# EAGLE design dice-2 (EAGLE 7.1.0)
CNAME: Pyrina; CREVISION: 1.0; DESIGNER: Jos Bodewes
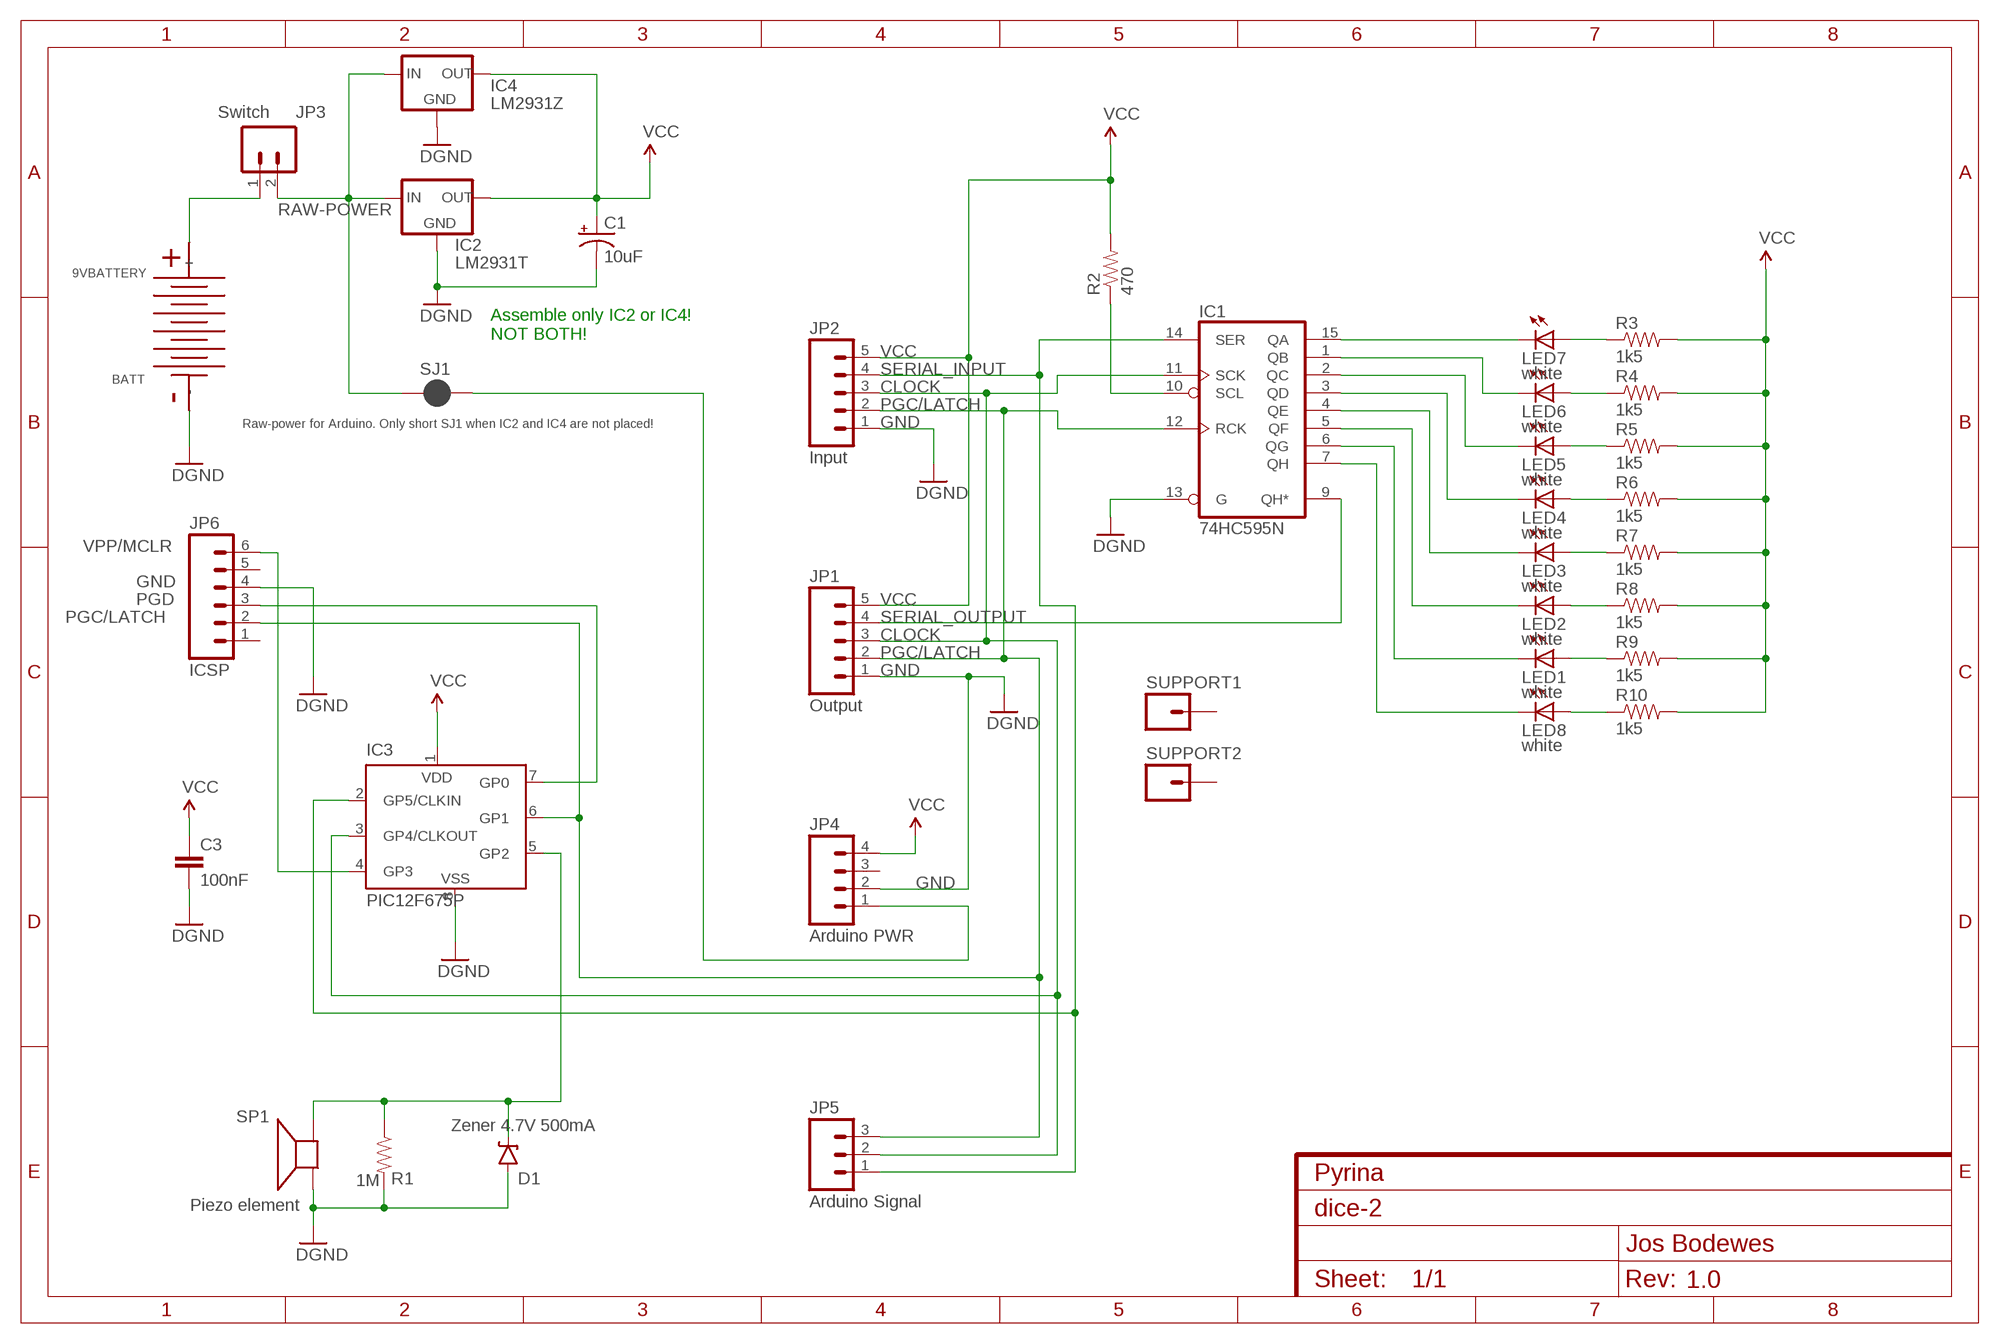
[diagram p0: schematic, sheet 1]

## Parts
BATT  9VBATTERY  [9V-BATTERY-HOLDER]
C1  10uF  CAP_POLPTH2  [CPOL-RADIAL-10UF-25V]
C3  100nF  CAPPTH1  [CAP-PTH-5MM]
D1  Zener 4.7V 500mA  DIODE-ZENERPTH  [DIODE-ZENER]
IC1  74HC595N  [DIL16]
IC2  LM2931T  [TO220S]
IC3  PIC12F675P  [DIL8]
IC4  LM2931Z  [TO92]
JP1  Output  M05PTH  [1X05]
JP2  Input  M05PTH  [1X05]
JP3  Switch  M02PTH  [1X02]
JP4  Arduino PWR  M04PTH  [1X04]
JP5  Arduino Signal  M03PTH  [1X03]
JP6  ICSP  M06SIP_LOCK  [1X06-SIP_LOCK]
LED1  white  LED5MM  [LED5MM]
LED2  white  LED5MM  [LED5MM]
LED3  white  LED5MM  [LED5MM]
LED4  white  LED5MM  [LED5MM]
LED5  white  LED5MM  [LED5MM]
LED6  white  LED5MM  [LED5MM]
LED7  white  LED5MM  [LED5MM]
LED8  white  LED5MM  [LED5MM]
R1  1M  RESISTORPTH-1/4W  [AXIAL-0.4]
R2  470  RESISTORPTH-1/4W  [AXIAL-0.4]
R3  1k5  RESISTORPTH-1/4W  [AXIAL-0.4]
R4  1k5  RESISTORPTH-1/4W  [AXIAL-0.4]
R5  1k5  RESISTORPTH-1/4W  [AXIAL-0.4]
R6  1k5  RESISTORPTH-1/4W  [AXIAL-0.4]
R7  1k5  RESISTORPTH-1/4W  [AXIAL-0.4]
R8  1k5  RESISTORPTH-1/4W  [AXIAL-0.4]
R9  1k5  RESISTORPTH-1/4W  [AXIAL-0.4]
R10  1k5  RESISTORPTH-1/4W  [AXIAL-0.4]
SJ1  Raw-power for Arduino. Only short SJ1 when IC2 and IC4 are not placed!  JUMPER-PAD-2-NC_BY_PASTE  [PAD-JUMPER-2-NC_BY_PASTE_YES_SILK]
SP1  Piezo element  SPEAKER/PS12  [PS12]
SUPPORT1  M01PTH  [1X01]
SUPPORT2  M01PTH  [1X01]

## Nets
CLOCK: IC1.11(SCK) IC3.3(GP4/CLKOUT) JP1.3 JP2.3 JP5.2
GND: BATT.- C1.2(-) C3.2 D1.P$2(A) IC1.13(G) IC2.2(GND) IC3.8(VSS) IC4.2(GND) JP1.1 JP2.1 JP4.2 JP6.4 R1.P$2 SP1.P$1(+) ; supply symbol labelled DGND
N$1: IC1.15(QA) LED7.K(C)
N$2: IC1.1(QB) LED6.K(C)
N$3: IC1.5(QF) LED2.K(C)
N$4: IC1.2(QC) LED5.K(C)
N$5: IC1.3(QD) LED4.K(C)
N$6: IC1.4(QE) LED3.K(C)
N$7: LED6.A R4.P$1
N$8: IC1.6(QG) LED1.K(C)
N$9: LED7.A R3.P$1
N$10: LED5.A R5.P$1
N$11: LED4.A R6.P$1
N$12: LED3.A R7.P$1
N$13: LED1.A R9.P$1
N$14: BATT.+ JP3.1
N$16: IC1.7(QH) LED8.K(C)
N$17: LED8.A R10.P$1
N$18: IC1.10(SCL) R2.P$1
N$19: D1.P$1(C) IC3.5(GP2) R1.P$1 SP1.P$2(-)
N$20: JP4.1 SJ1.2
N$22: LED2.A R8.P$1
PGC/LATCH: IC1.12(RCK) IC3.6(GP1) JP1.2 JP2.2 JP5.3 JP6.2
PGD: IC3.7(GP0) JP6.3
RAW-POWER: IC2.1(IN) IC4.3(IN) JP3.2 SJ1.1
SERIAL_INPUT: IC1.14(SER) IC3.2(GP5/CLKIN) JP2.4 JP5.1
SERIAL_OUTPUT: IC1.9(QH*) JP1.4
VCC: C1.1(+) C3.1 IC2.3(OUT) IC3.1(VDD) IC4.1(OUT) JP1.5 JP2.5 JP4.4 R2.P$2 R3.P$2 R4.P$2 R5.P$2 R6.P$2 R7.P$2 R8.P$2 R9.P$2 R10.P$2
VPP/MCLR: IC3.4(GP3) JP6.6
Unconnected: JP4.3 JP6.1 JP6.5 SUPPORT1.1 SUPPORT2.1

## Notes on the sheet
- Assemble only IC2 or IC4!
  NOT BOTH!

## Power pins joined to a net without a drawn wire
GND: IC1.8(GND)
VCC: IC1.16(VCC)

## Library data of the parts
BATT = battery:9VBATTERY: 9V battery
C1 = SparkFun-Capacitors:CAP_POL: Capacitor Polarized These are standard SMD and PTH capacitors. Normally 10uF, 47uF, and 100uF in electrolytic and tantalum varieties. Always verify the external diameter of the through hole cap, it varies with capacity, voltage, and manufacturer. The EIA devices should be standard.
C3 = SparkFun-Capacitors:CAP: Capacitor Standard 0603 ceramic capacitor, and 0.1" leaded capacitor.
D1 = SparkFun-DiscreteSemi:DIODE-ZENER: Zener Diode Production Part - 8199 3.4V Zener Voltage
IC1 = 74xx-eu:74*595: 8-bit SHIFT REGISTER, output latch
IC2 IC4 = v-reg-3:LM2931: National Semiconductor <http://www.national.com> Low Dropout Fixed Regulator Vin up to 26V, Reverse Batterie/Load Dump/Short Circuit/Overload Protection,
IC3 = microchip:PIC12F6*: Data Sheet 8-Pin FLASH-Based 8-Bit CMOS Microcontrollers Source: http://www.microchip.com .. 41190c.pdf; MF: MICROCHIP; MPN: PIC12F675-E/P; OC_FARNELL: 9759018; OC_NEWARK: 92C4340
JP1 JP2 = SparkFun-Connectors:M05: Header 5 Standard 5-pin 0.1" header. Use with straight break away headers (SKU : PRT-00116), right angle break away headers (PRT-00553), swiss pins (PRT-00743), machine pins (PRT-00117), and female headers (PRT-00115). Molex polarized connector foot print use with SKU : PRT-08230 with associated crimp pins and housings.
JP3 = SparkFun-Connectors:M02: Standard 2-pin 0.1" header. Use with - straight break away headers ( PRT-00116) - right angle break away headers (PRT-00553) - swiss pins (PRT-00743) - machine pins (PRT-00117) - female headers (PRT-00115) Molex polarized connector foot print use with: PRT-08233 with associated crimp pins and housings. 2.54_SCREWTERM for use with PRT-10571. 3.5mm Screw Terminal footprints for PRT-08084 5mm Screw Terminal footprints for use with PRT-08432
JP4 = SparkFun-Connectors:M04: Header 4 Standard 4-pin 0.1" header. Use with straight break away headers (SKU : PRT-00116), right angle break away headers (PRT-00553), swiss pins (PRT-00743), machine pins (PRT-00117), and female headers (PRT-00115). Molex polarized connector foot print use with SKU : PRT-08231 with associated crimp pins and housings. 1MM SMD Version SKU: PRT-10208
JP5 = SparkFun-Connectors:M03: Header 3 Standard 3-pin 0.1" header. Use with straight break away headers (SKU : PRT-00116), right angle break away headers (PRT-00553), swiss pins (PRT-00743), machine pins (PRT-00117), and female headers (PRT-00115). Molex polarized connector foot print use with SKU : PRT-08232 with associated crimp pins and housings.
JP6 = SparkFun-Connectors:M06: Header 6 Standard 6-pin 0.1" header. Use with straight break away headers (SKU : PRT-00116), right angle break away headers (PRT-00553), swiss pins (PRT-00743), machine pins (PRT-00117), and female headers (PRT-00115). Molex polarized connector foot print use with SKU : PRT-08094 with associated crimp pins and housings. NOTES ON THE VARIANTS LOCK and LOCK_LONGPADS... This footprint was designed to help hold the alignment of a through-hole component (i.e. 6-pin header) while soldering it into place. You may notice that each hole has been shifted either up or down by 0.005 of an inch from it's more standard position (which is a perfectly straight line). This slight alteration caused the pins (the squares in the middle) to touch the edges of the holes. Because they are alternating, it causes a "brace" to hold the component in place. 0.005 has proven to be the perfect amount of "off-center" position when using our standard breakaway headers. Although looks a little odd when you look at the bare footprint, once you have a header in there, the alteration is very hard to notice. Also,if you push a header all the way into place, it is covered up entirely on the bottom side. This idea of altering the position of holes to aid alignment will be further integrated into the Sparkfun Library for other footprints. It can help hold any component with 3 or more connection pins.
LED1-LED8 = led:LED: LED OSRAM: - CHIPLED LG R971, LG N971, LY N971, LG Q971, LY Q971, LO R971, LY R971 LH N974, LH R974 LS Q976, LO Q976, LY Q976 LO Q996 - Hyper CHIPLED LW Q18S LB Q993, LB Q99A, LB R99A - SideLED LS A670, LO A670, LY A670, LG A670, LP A670 LB A673, LV A673, LT A673, LW A673 LH A674 LY A675 LS A676, LA A676, LO A676, LY A676, LW A676 LS A679, LY A679, LG A679 - Hyper Micro SIDELED® LS Y876, LA Y876, LO Y876, LY Y876 LT Y87S - SmartLED LW L88C, LW L88S LB L89C, LB L89S, LG L890 LS L89K, LO L89K, LY L89K LS L896, LA L896, LO L896, LY L896 - TOPLED LS T670, LO T670, LY T670, LG T670, LP T670 LSG T670, LSP T670, LSY T670, LOP T670, LYG T670 LG T671, LOG T671, LSG T671 LB T673, LV T673, LT T673, LW T673 LH T674 LS T676, LA T676, LO T676, LY T676, LB T676, LH T676, LSB T676, LW T676 LB T67C, LV T67C, LT T67C, LS T67K, LO T67K, LY T67K, LW E67C LS E67B, LA E67B, LO E67B, LY E67B, LB E67C, LV E67C, LT E67C LW T67C LS T679, LY T679, LG T679 LS T770, LO T770, LY T770, LG T770, LP T770 LB T773, LV T773, LT T773, LW T773 LH T774 LS E675, LA E675, LY E675, LS T675 LS T776, LA T776, LO T776, LY T776, LB T776 LHGB T686 LT T68C, LB T68C - Hyper Mini TOPLED® LB M676 - Mini TOPLED Santana® LG M470 LS M47K, LO M47K, LY M47K Source: http://www.osram.convergy.de LUXEON: - LUMILED® LXK2-PW12-R00, LXK2-PW12-S00, LXK2-PW14-U00, LXK2-PW14-V00 LXK2-PM12-R00, LXK2-PM12-S00, LXK2-PM14-U00 LXK2-PE12-Q00, LXK2-PE12-R00, LXK2-PE12-S00, LXK2-PE14-T00, LXK2-PE14-U00 LXK2-PB12-K00, LXK2-PB12-L00, LXK2-PB12-M00, LXK2-PB14-N00, LXK2-PB14-P00, LXK2-PB14-Q00 LXK2-PR12-L00, LXK2-PR12-M00, LXK2-PR14-Q00, LXK2-PR14-R00 LXK2-PD12-Q00, LXK2-PD12-R00, LXK2-PD12-S00 LXK2-PH12-R00, LXK2-PH12-S00 LXK2-PL12-P00, LXK2-PL12-Q00, LXK2-PL12-R00 Source: www.luxeon.com KINGBRIGHT: KA-3528ASYC Source: www.kingbright.com
R1-R10 = SparkFun-Resistors:RESISTOR: Resistor Basic schematic elements and footprints for 0603, 1206, and PTH resistors.
SJ1 = SparkFun-Passives:JUMPER-PAD-2-NC_BY_PASTE
SP1 = adafruit:SPEAKER: SPEAKER Source: Buerklin Added PS12 (for part # PS1240 piezo) http://www.ladyada.net/library/pcb/eaglelibrary.html
SUPPORT1 SUPPORT2 = SparkFun-Connectors:M01: Header 1 Standard 1-pin 0.1" header. Use with straight break away headers (SKU : PRT-00116), right angle break away headers (PRT-00553), swiss pins (PRT-00743), machine pins (PRT-00117), and female headers (PRT-00115).

## Net classes
0 default: width 0.4 mm, clearance 0.205 mm
1 GND: width 0.4 mm

## Board
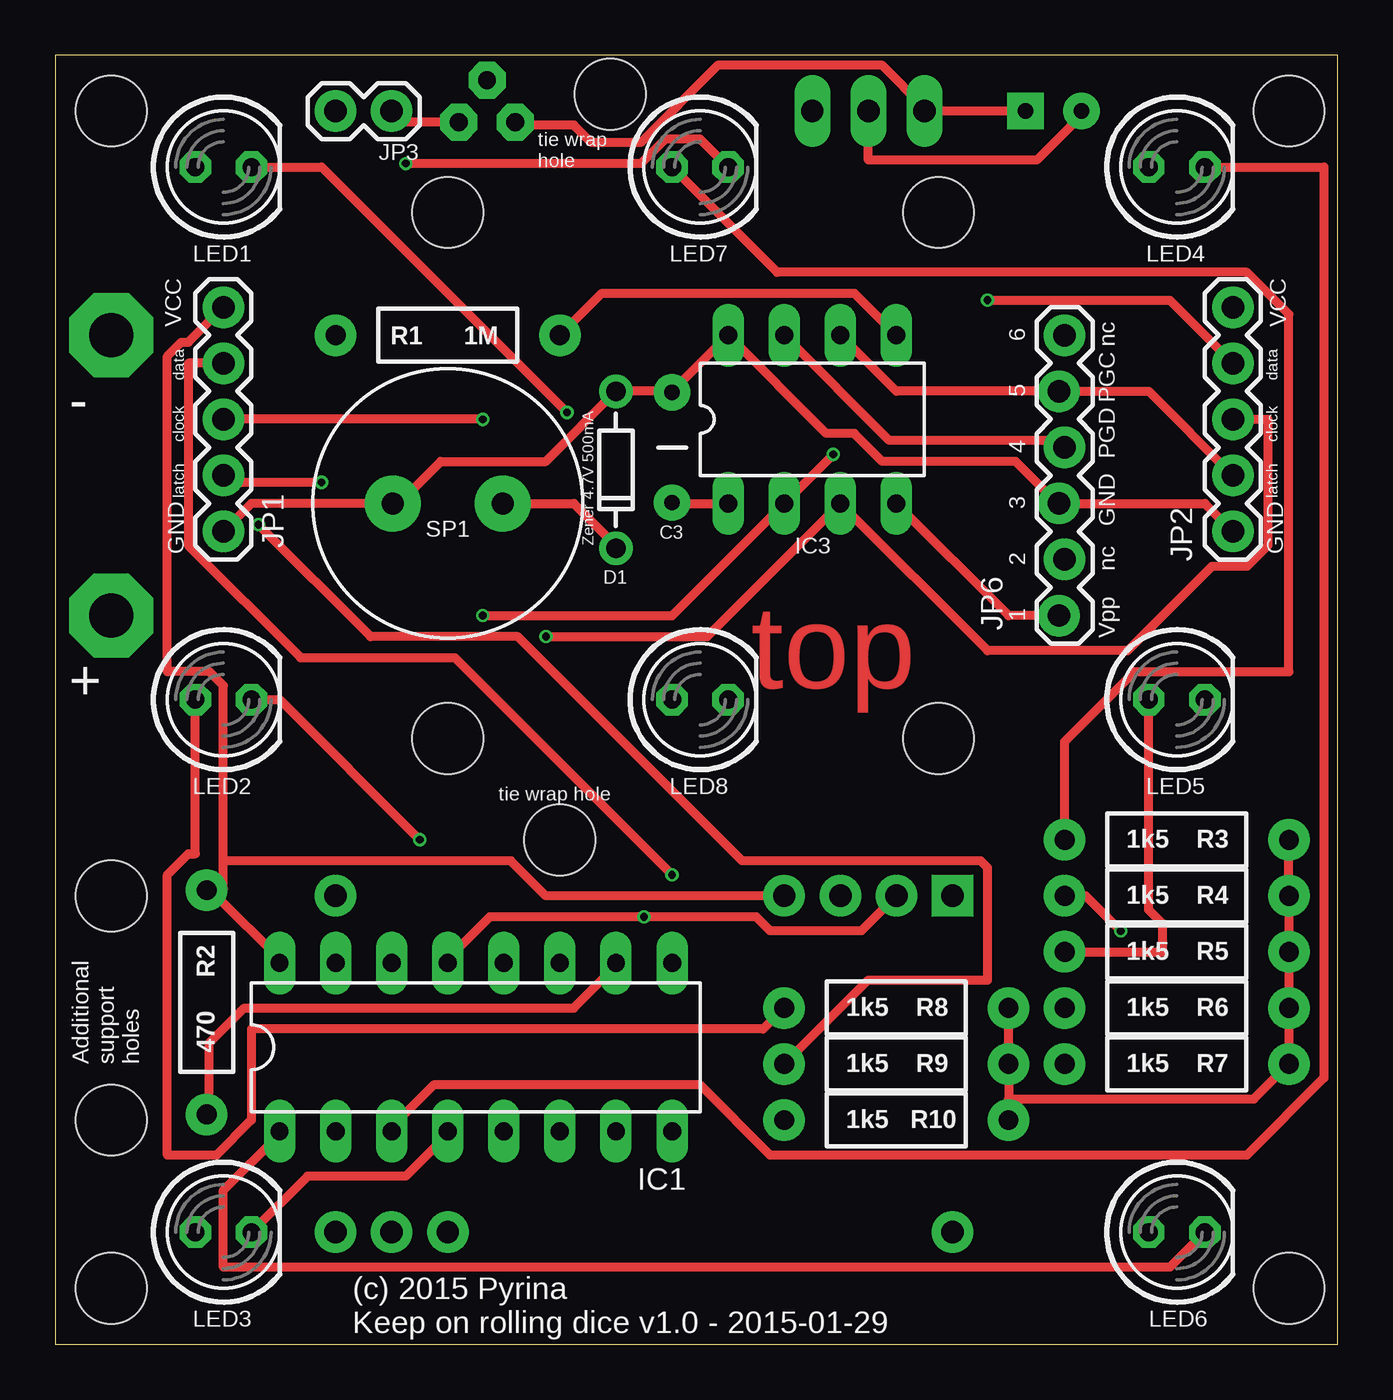
[diagram p1: board, top side]
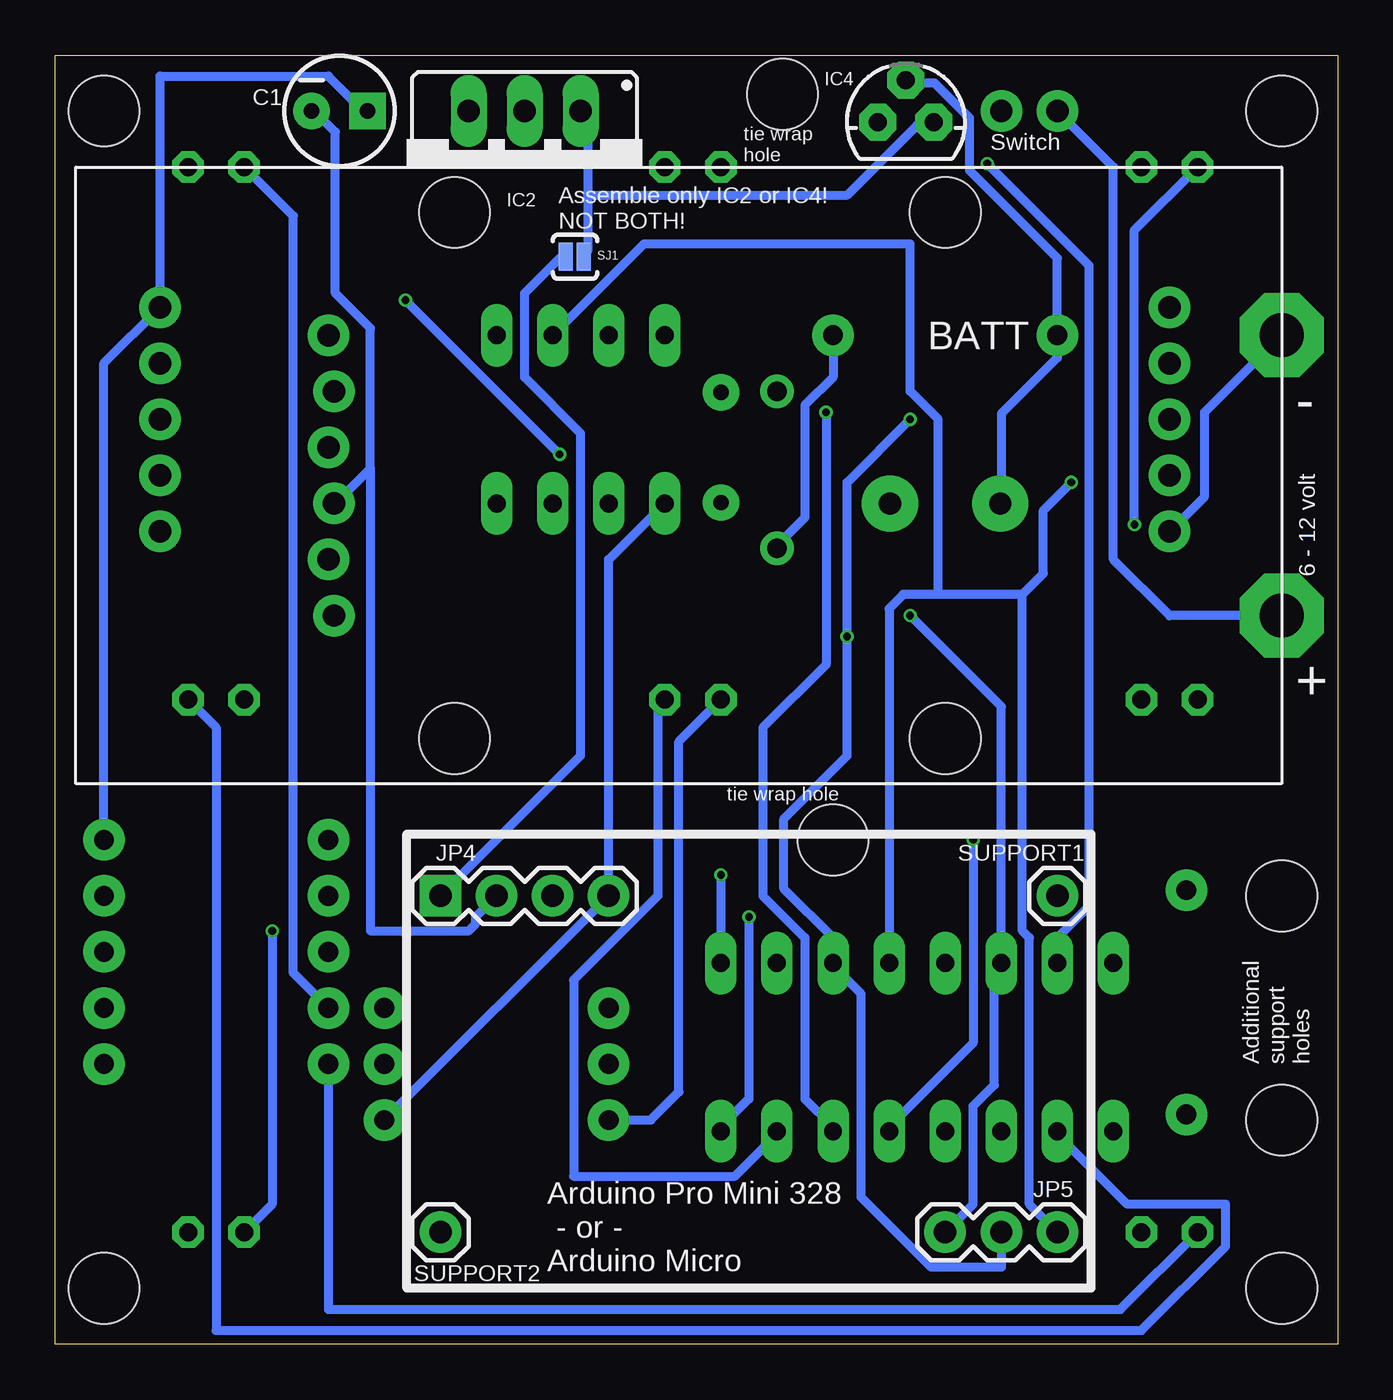
[diagram p2: board, bottom side, seen from below]

Size 58.09 x 58.41 mm. Coordinates in mm from the lower left corner, seen from the top.
Outline: 0,0 58.09,0 58.09,58.41 0,58.41 0,0
Copper layers (1*16): Top 0.018mm / dielectric 1.55mm / Bottom 0.018mm
Design rules "eC_2Layer_PClass6_BaseCopperO18_eCDefault *": minimum track width 10mil, minimum drill 0.35mm, track to track 0.15mm, track to pad 0.15mm, pad to pad 0.15mm, via to via 0.15mm, smd to smd 0mil, copper to edge 0.25mm, drill to drill 0.35mm, minimum pad ring 12mil, minimum via ring 0.125mm, stop-mask expansion 0mil, vias tented up to drill 0.45mm, thermal gap 0.2mm
Holes 3.2 mm at 2.54,55.88 55.88,55.88 55.88,2.54 2.54,2.54 2.54,20.32 2.54,10.16 25.15,56.64 22.86,22.86

### Footprints (pad centres in the part's own frame; a part is rotated, then mirrored left to right if it is on the bottom)
9V-BATTERY-HOLDER = drill 2 pad 3.81 octagon: + 0,6.35; - 0,-6.35 | hole 3.2: 15.24,11.913; 15.24,-11.913; 37.465,-11.913; 37.465,11.913
CPOL-RADIAL-10UF-25V = drill 0.7 pad 1.651 square: 1 1.27,0 | drill 0.7 pad 1.651: 2 -1.27,0
CAP-PTH-5MM = drill 0.7 pad 1.651: 1 -2.5,0; 2 2.5,0
DIODE-ZENER = drill 0.9: P$1 -3.556,0; P$2 3.556,0
DIL16 = drill 0.813 long: 1 -8.89,-3.81; 2 -6.35,-3.81; 3 -3.81,-3.81; 4 -1.27,-3.81; 5 1.27,-3.81; 6 3.81,-3.81; 7 6.35,-3.81; 8 8.89,-3.81; 9 8.89,3.81; 10 6.35,3.81; 11 3.81,3.81; 12 1.27,3.81; 13 -1.27,3.81; 14 -3.81,3.81; 15 -6.35,3.81; 16 -8.89,3.81
TO220S = drill 1.016 long: 1 -2.54,-2.54; 2 0,-2.54; 3 2.54,-2.54
DIL8 = drill 0.813 long: 1 -3.81,-3.81; 2 -1.27,-3.81; 3 1.27,-3.81; 4 3.81,-3.81; 5 3.81,3.81; 6 1.27,3.81; 7 -1.27,3.81; 8 -3.81,3.81
TO92 = drill 0.813 pad 1.676 octagon: 1 -1.27,0; 2 0,1.905; 3 1.27,0
1X05 = drill 1.016 pad 1.88: 1 0,0; 2 2.54,0; 3 5.08,0; 4 7.62,0; 5 10.16,0
1X02 = drill 1.016 pad 1.88: 1 0,0; 2 2.54,0
1X04 = drill 1.016 pad 1.88 square: 1 0,0 | drill 1.016 pad 1.88: 2 2.54,0; 3 5.08,0; 4 7.62,0
1X03 = drill 1.016 pad 1.88: 1 0,0; 2 2.54,0; 3 5.08,0
1X06-SIP_LOCK = drill 1.016 pad 1.88: 1 0,0; 2 2.54,-0.254; 3 5.08,0; 4 7.62,-0.254; 5 10.16,0; 6 12.7,-0.254
LED5MM = drill 0.813 octagon: A -1.27,0; K 1.27,0
AXIAL-0.4 = drill 0.9 pad 1.88: P$1 -5.08,0; P$2 5.08,0
PAD-JUMPER-2-NC_BY_PASTE_YES_SILK = smd 0.635 x 1.27: 1 -0.401,0; 2 0.413,0
PS12 = drill 1 pad 2.54: P$1 -2.5,0; P$2 2.5,0
1X01 = drill 1.016 pad 1.88: 1 0,0

### Placement (x,y rotation side)
BATT  2.54,39.37 180 bottom
C1  45.21,55.88 0 bottom
C3  27.94,40.64 90 top
D1  25.4,39.62 90 top
IC1  19.05,13.46 0 top
IC2  36.83,53.34 180 bottom
IC3  34.29,41.91 0 top
IC4  19.56,55.37 0 bottom
JP1  7.62,36.83 90 top
JP2  53.34,36.83 90 top
JP3  12.7,55.88 0 top
JP4  40.64,20.32 0 bottom
JP5  17.78,5.08 0 bottom
JP6  45.72,45.72 270 top
LED1  7.62,53.34 0 top
LED2  7.62,29.21 0 top
LED3  7.62,5.08 0 top
LED4  50.8,53.34 0 top
LED5  50.8,29.21 0 top
LED6  50.8,5.08 0 top
LED7  29.21,53.34 0 top
LED8  29.21,29.21 0 top
R1  17.78,45.72 180 top
R2  6.86,15.49 90 top
R3  50.8,22.86 0 top
R4  50.8,20.32 0 top
R5  50.8,17.78 0 top
R6  50.8,15.24 0 top
R7  50.8,12.7 0 top
R8  38.1,15.24 0 top
R9  38.1,12.7 0 top
R10  38.1,10.16 0 top
SJ1  34.54,49.28 180 bottom
SP1  17.78,38.1 0 top
SUPPORT1  12.7,20.32 0 bottom
SUPPORT2  40.64,5.08 0 bottom

### Tracks (layer width: path | path; a pad name or v marks a point on that pad's centre or on a via)
CLOCK  (via drill 0.35)
  Top 0.4: JP2.3 54.93,41.91 54.93,36.2 53.98,35.24 52.39,35.24 48.58,31.43 42.23,31.43 IC3.3 29.53,32.07 v22.23,32.07 | v19.37,41.91 JP1.3
  Bottom 0.4: JP5.2 15.24,3.49 18.41,3.49 21.59,6.67 21.59,15.88 22.86,17.14 IC1.11 22.86,18.41 25.08,20.64 25.08,23.81 22.23,26.67 v22.23,32.07 22.23,39.05 v19.37,41.91
GND  (via drill 0.35)
  Top 0.4: 27.94,43.18 IC3.8 34.92,41.27 36.2,41.27 37.47,40.01 43.5,40.01 45.4,38.1 JP6.4 52.07,38.1 JP2.1 | 27.94,43.18 D1.P$2 22.23,40.01 17.46,40.01 15.56,38.1 SP1.P$1 8.89,38.1 JP1.1 | 27.94,43.18 C3.2 | JP4.2 36.51,18.73 32.38,18.73 31.75,19.37 v26.67,19.37 19.68,19.37 17.78,17.46 IC1.13 | IC2.2 36.83,53.66 44.45,53.66 46.67,55.88 C1.2
  Bottom 0.4: BATT.- 6.03,42.23 6.03,38.42 JP1.1 | v26.67,19.37 26.67,11.11 27.94,9.84 IC1.8 | 43.81,39.69 43.81,46.04 45.4,47.62 45.4,54.93 46.35,55.88 C1.2 | 43.81,39.69 45.4,38.1 JP6.4 | JP4.2 39.05,19.37 39.05,19.05 39.37,18.73 43.81,18.73 43.81,39.69 | R1.P$2 12.7,49.21 16.67,53.18 16.67,55.56 18.26,57.15 19.53,57.15 IC4.2
  Bottom 0.406: R1.P$2 12.7,44.7 15.24,42.16 15.24,38.14 SP1.P$1
N$1  (via drill 0.35)
  Top 0.4: v15.88,53.5 26.51,53.5 27.62,54.61 29.21,54.61 LED7.K
  Bottom 0.4: IC1.15 12.7,18.41 11.27,19.84 11.27,48.9 v15.88,53.5
N$2
  Top 0.4: LED6.K 50.48,3.49 7.62,3.49 7.62,6.99 10.16,9.53 IC1.1
N$3  (via drill 0.35)
  Top 0.4: v16.51,22.86 10.16,29.21 LED2.K
  Bottom 0.4: v16.51,22.86 16.51,13.65 20.32,9.84 IC1.5
N$4
  Bottom 0.4: LED5.K 50.8,27.94 50.8,0.64 8.89,0.64 5.08,4.45 5.08,6.35 9.53,6.35 12.7,9.53 IC1.2
N$5
  Top 0.4: LED4.K 57.47,53.34 57.47,12.06 53.98,8.57 32.38,8.57 29.21,11.75 17.14,11.75 15.24,9.84 IC1.3
N$6
  Top 0.4: LED3.K 11.43,7.62 15.88,7.62 17.78,9.53 IC1.4
N$7  (via drill 0.35)
  Top 0.4: v48.26,18.73 46.67,20.32 R4.P$1
  Bottom 0.4: LED6.A 48.26,6.35 v48.26,18.73
N$8  (via drill 0.35)
  Top 0.4: v23.18,42.23 12.06,53.34 LED1.K
  Bottom 0.4: v23.18,42.23 23.18,30.8 26.04,27.94 26.04,20.32 24.13,18.41 24.13,11.11 22.86,9.84 IC1.6
N$9
  Top 0.4: LED7.A 32.7,48.58 53.98,48.58 55.88,46.67 55.88,30.48 48.9,30.48 45.72,27.3 R3.P$1
N$10
  Top 0.4: LED5.A 49.53,19.68 50.16,19.05 50.16,17.78 R5.P$1
N$11
  Bottom 0.4: LED4.A 47.31,51.12 47.31,16.83 R6.P$1
N$12
  Bottom 0.4: LED3.A 9.84,1.59 45.72,1.59 R7.P$1
N$13  (via drill 0.35)
  Top 0.4: v9.21,37.15 14.29,32.07 20.95,32.07 31.11,21.91 41.91,21.91 42.23,21.59 42.23,16.51 36.83,16.51 R9.P$1
  Bottom 0.4: LED1.A 9.21,50.48 v9.21,37.15
N$14
  Bottom 0.4: JP3.1 10.16,53.34 10.16,35.56 7.62,33.02 BATT.+
N$16
  Bottom 0.4: LED8.K 30.8,28.89 30.8,20.32 34.61,16.51 34.61,7.62 27.3,7.62 25.4,9.53 IC1.7
N$17
  Bottom 0.4: LED8.A 29.84,27.3 29.84,11.43 31.11,10.16 R10.P$1
N$18
  Top 0.4: IC1.10 25.4,17.14 23.5,15.24 8.57,15.24 6.99,13.65 6.99,10.48 R2.P$1
N$19
  Top 0.4: SP1.P$2 23.5,38.1 25.4,36.2 D1.P$1 | IC3.5 36.2,47.62 24.77,47.62 R1.P$1
  Bottom 0.4: R1.P$1 22.86,43.81 24.13,42.55 24.13,37.47 25.4,36.2 D1.P$1
N$20
  Bottom 0.4: JP4.1 34.29,26.67 34.29,41.27 36.83,43.81 36.83,47.62 35.24,49.21 SJ1.2
N$22
  Top 0.4: LED2.A 6.35,22.23 6.03,22.23 5.08,21.27 5.08,8.57 7.3,8.57 8.89,10.16 8.89,14.29 32.07,14.29 R8.P$1
PGC/LATCH  (via drill 0.35)
  Top 0.4: IC3.6 38.1,43.18 JP6.2 49.53,43.18 JP2.2 | JP1.2 7.94,39.05 v12.06,39.05
  Bottom 0.4: IC1.12 20.32,33.34 19.68,33.97 18.1,33.97 | 14.29,33.97 18.1,33.97 | 14.29,33.97 14.29,18.73 13.97,18.41 13.97,6.35 JP5.3 | v12.06,39.05 13.34,37.78 13.34,34.92 14.29,33.97 | IC3.6 31.43,49.85 19.37,49.85 19.37,43.18 18.1,41.91 18.1,33.97
PGD
  Top 0.4: IC3.7 37.78,40.96 45.4,40.96 JP6.3
RAW-POWER
  Top 0.4: JP3.2 15.72,55.4 18.26,55.4 IC4.3
  Bottom 0.4: 33.97,52.07 33.97,55.56 IC2.1 | 33.97,52.07 33.97,49.53 SJ1.1 | 33.97,52.07 22.23,52.07 19.05,55.24 18.41,55.24 IC4.3
SERIAL_INPUT  (via drill 0.35)
  Top 0.4: v19.37,33.02 27.94,33.02 IC3.2 v35.24,40.32 | JP2.4 50.48,47.31 v42.23,47.31
  Bottom 0.4: JP5.1 16.51,6.35 16.51,10.79 15.56,11.75 15.56,16.83 15.24,17.14 IC1.14 15.24,28.89 v19.37,33.02 | v35.24,40.32 v42.23,47.31
SERIAL_OUTPUT  (via drill 0.35)
  Top 0.4: v27.94,21.27 18.1,31.11 11.11,31.11 6.03,36.2 6.03,44.45 JP1.4
  Bottom 0.4: v27.94,21.27 IC1.9
VCC
  Top 0.4: C1.1 IC2.3 39.37,56.04 37.47,57.94 30,57.94 26.51,54.45 24.29,54.45 23.5,55.24 20.95,55.24 IC4.1 | R3.P$2 R4.P$2 R5.P$2 R6.P$2 R7.P$2 54.29,11.11 43.18,11.11 | IC1.16 10.16,17.46 7.3,20.32 6.99,20.32 R2.P$2 6.99,20.64 7.62,20.64 7.62,21.91 | JP1.5 6.03,45.4 5.71,45.4 5.08,44.77 5.08,30.48 6.99,30.48 7.62,29.84 7.62,21.91 | IC3.1 27.94,38.1 C3.1 | 43.18,11.11 R9.P$2 R8.P$2 | 43.18,11.11 R10.P$2 | 7.62,21.91 20.64,21.91 22.23,20.32 JP4.4
  Bottom 0.4: R3.P$2 55.88,44.45 JP2.5 53.34,57.47 45.72,57.47 44.13,55.88 C1.1 | R10.P$2 JP4.4 33.02,35.56 IC3.1
VPP/MCLR
  Top 0.4: IC3.4 43.18,33.02 JP6.6

### Text on the board
Top: top
tNames: tie wrap / hole | VCC | VCC | 6 | nc | data | data | 5 | PGC | - | clock | clock | 4 | PGD | latch | 3 | latch | GND | GND | GND | 2 | nc | 1 | Vpp | + | tie wrap hole | Additional / support / holes | (c) 2015 Pyrina / Keep on rolling dice v1.0 - 2015-01-29
bNames: Switch | tie wrap / hole | Assemble only IC2 or IC4! / NOT BOTH! | - | 6 - 12 volt | + | tie wrap hole | Additional / support / holes | Arduino Pro Mini 328 / - or - / Arduino Micro